# EAGLE schematic PCB Capacitor (EAGLE 9.6.2)
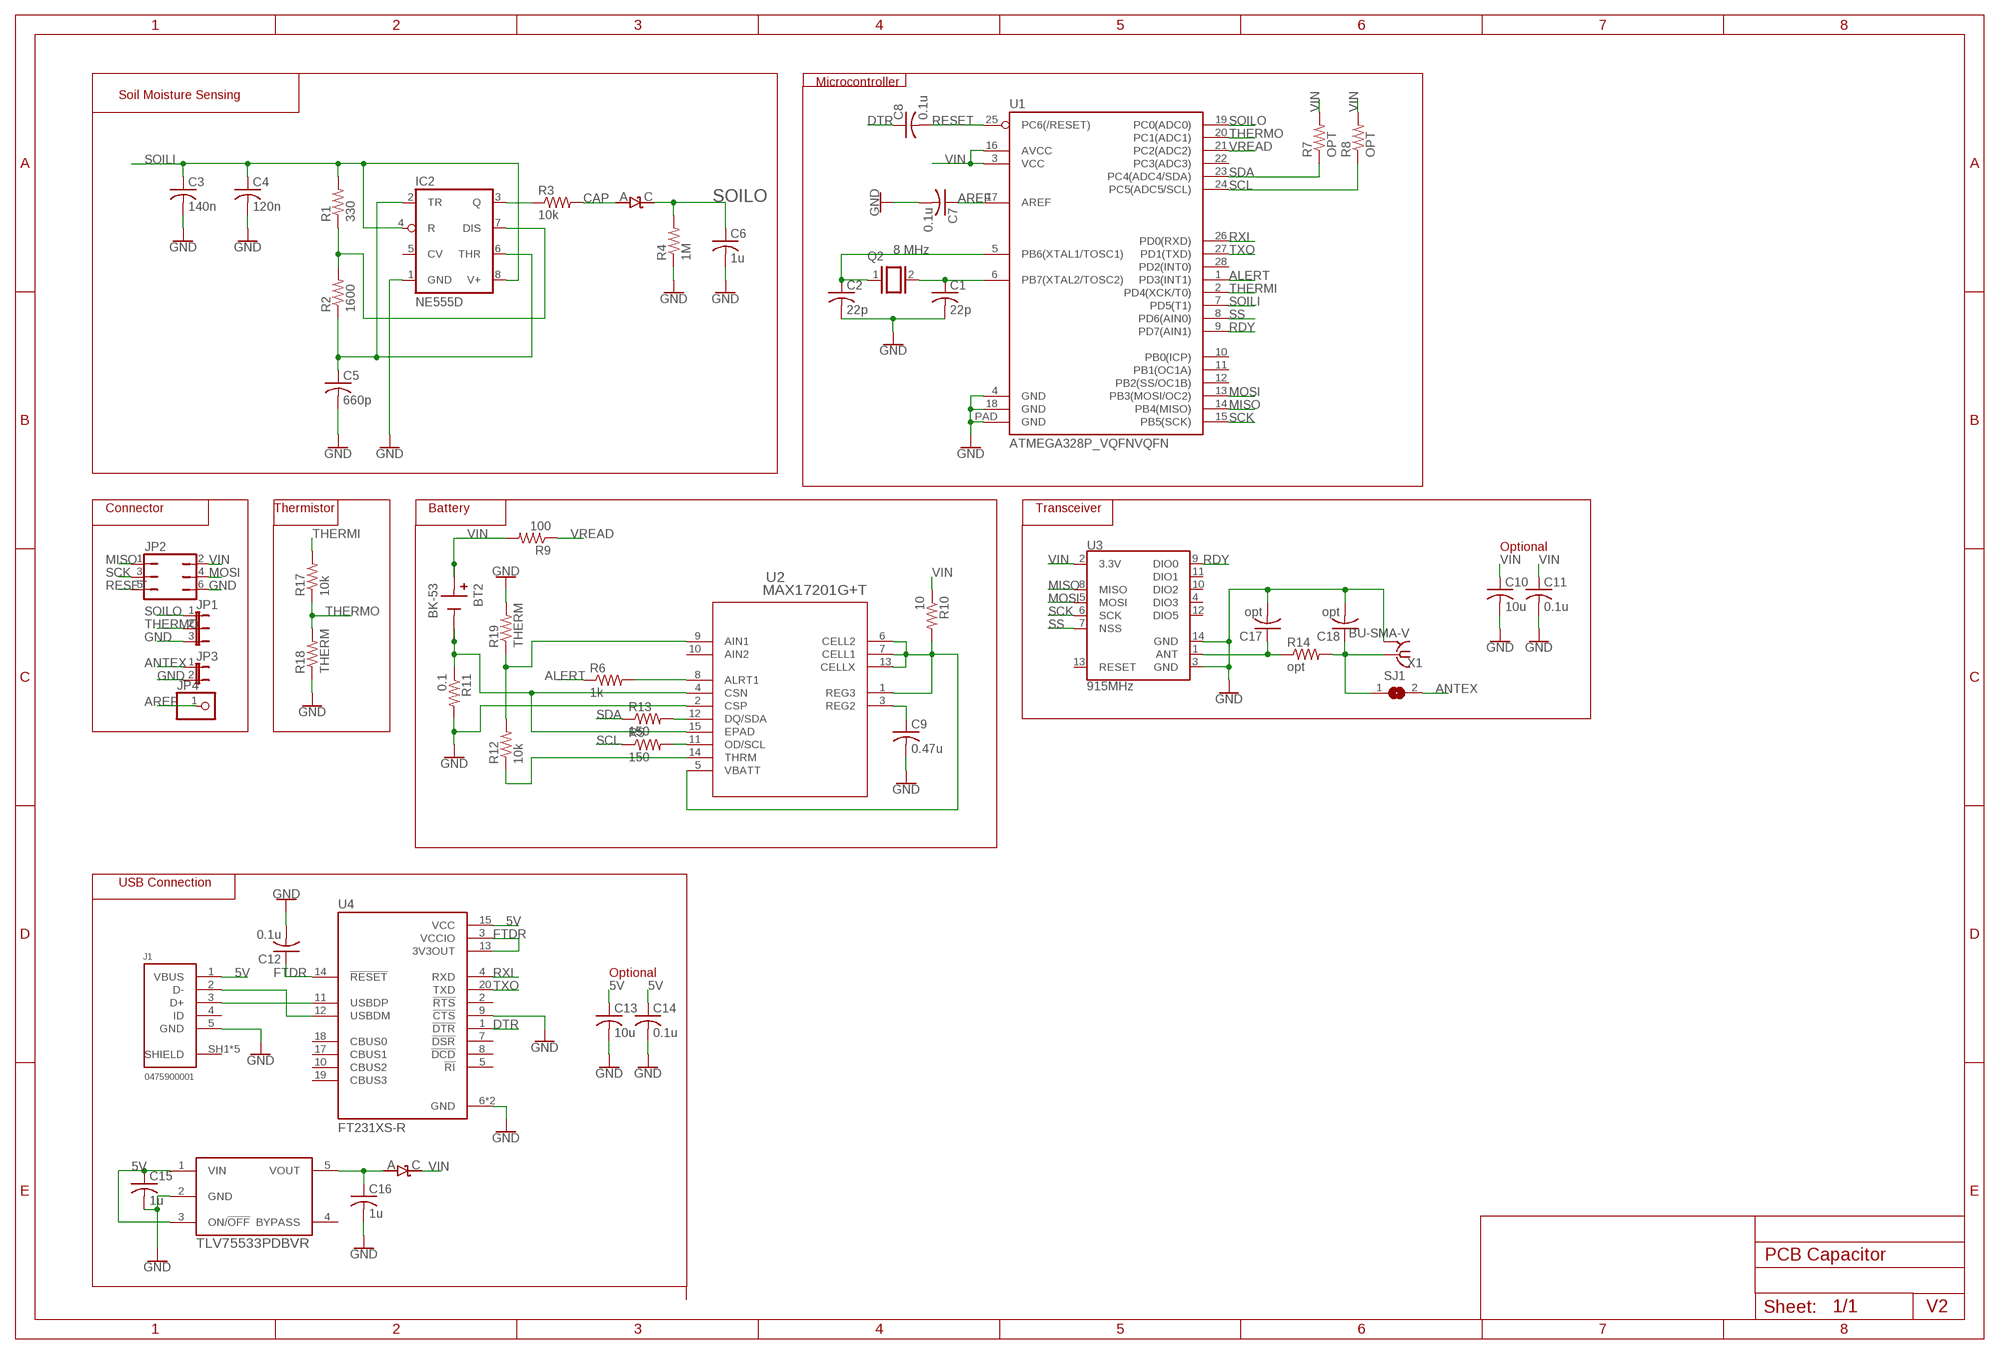
[diagram p0: schematic, sheet 1]

## Parts
BT2  BK-53  [BAT_BK-53]
C1  22p  C-USC0805  [C0805]
C2  22p  C-USC0805  [C0805]
C3  140n  C-USC0805  [C0805]
C4  120n  C-USC0805  [C0805]
C5  660p  C-USC0805  [C0805]
C6  1u  C-USC0805  [C0805]
C7  0.1u  C-USC0805  [C0805]
C8  0.1u  C-USC0805  [C0805]
C9  0.47u  C-USC0805  [C0805]
C10  10u  C-USC0805  [C0805]
C11  0.1u  C-USC0805  [C0805]
C12  0.1u  C-USC0805  [C0805]
C13  10u  C-USC0805  [C0805]
C14  0.1u  C-USC0805  [C0805]
C15  1u  C-USC0805  [C0805]
C16  1u  C-USC0805  [C0805]
C17  opt  C-USC0805  [C0805]
C18  opt  C-USC0805  [C0805]
D1  DIODE_SCHOTTKY_CMMSH2-40  [SOD-123]
D11  DIODE_SCHOTTKY_CMMSH2-40  [SOD-123]
IC2  NE555D  [SO08]
J1  0475900001  [0475900001]
JP1  JP2E  [JP2]
JP2  JP3Q  [JP3Q]
JP3  JP1E  [JP1]
JP4  PINHD-1X1  [1X01]
Q2  8 MHz  XTAL/S  [QS]
R1  330  R-US_R0603  [R0603]
R2  1600  R-US_R0603  [R0603]
R3  10k  R-US_R0603  [R0603]
R4  1M  R-US_R0603  [R0603]
R5  150  R-US_R0603  [R0603]
R6  1k  R-US_R0603  [R0603]
R7  OPT  R-US_R0603  [R0603]
R8  OPT  R-US_R0603  [R0603]
R9  100  R-US_R0603  [R0603]
R10  10  R-US_R0603  [R0603]
R11  0.1  R-US_R0603  [R0603]
R12  10k  R-US_R0603  [R0603]
R13  150  R-US_R0603  [R0603]
R14  opt  R-US_R0603  [R0603]
R17  10k  R-US_R0603  [R0603]
R18  THERM  R-US_R0603  [R0603]
R19  THERM  R-US_R0603  [R0603]
SJ1  SJ  [SJ]
TLV75533PDBVR  LP2985-33DBVR  [SOT-23-5]
U1  ATMEGA328P_VQFNVQFN  [VQFN-28]
U2  MAX17201G+T  [21-0137_T1433-2C_MXM]
U3  915MHz  RFM69CW-915MHZ  [RFM69CW-XXXS2]
U4  FT231XS-R  [SOP63P599X175-20N]
X1  BU-SMA-V  [BU-SMA-V]

## Nets
5V: C13.1 C14.1 C15.1 J1.1(VBUS) TLV75533PDBVR.1(VIN) TLV75533PDBVR.3(ON/!OFF!) U4.15(VCC)
ALERT: R6.1 U1.1(PD3(INT1))
ANTEX: JP3.1 SJ1.2
AREF: C7.1 JP4.1 U1.17(AREF)
CAP: D11.A R3.2
DTR: C8.1 U4.1(!DTR)
FTDR: C12.1 U4.3(VCCIO) U4.13(3V3OUT) U4.14(!RESET)
GND [Power]: C1.2 C2.2 C3.2 C4.2 C5.2 C6.2 C7.2 C9.2 C10.2 C11.2 C12.2 C13.2 C14.2 C15.2 C16.2 C17.2 C18.2 IC2.1(GND) J1.5(GND) JP1.3 JP2.6 JP3.2 R4.1 R11.2 R18.1 R19.2 TLV75533PDBVR.2(GND) U1.4(GND) U1.18(GND) U1.PAD(GND) U2.2(CSP) U3.3(GND) U3.14(GND) U4.6(GND) U4.9(!CTS) U4.16(GND) X1.2 X1.3 X1.4 X1.5
MISO: JP2.1 U1.14(PB4(MISO)) U3.8(MISO)
MOSI: JP2.4 U1.13(PB3(MOSI/OC2)) U3.5(MOSI)
N$1: R12.1 U2.14(THRM)
N$2: IC2.7(DIS) R1.1 R2.2
N$3: C5.1 IC2.2(TR) IC2.6(THR) R2.1
N$4: BT2.1-(-) BT2.2-(-) R11.1 U2.4(CSN) U2.15(EPAD)
N$5: C9.1 U2.3(REG2)
N$6: C1.1 Q2.2 U1.6(PB7(XTAL2/TOSC2))
N$7: C2.1 Q2.1 U1.5(PB6(XTAL1/TOSC1))
N$8: J1.2(D-) U4.12(USBDM)
N$9: IC2.3(Q) R3.1
N$10: J1.3(D+) U4.11(USBDP)
N$12: R10.2 U2.1(REG3) U2.5(VBATT) U2.6(CELL2) U2.7(CELL1) U2.13(CELLX)
N$13: R12.2 R19.1 U2.9(AIN1)
N$14: R6.2 U2.8(ALRT1)
N$15: R13.2 U2.12(DQ/SDA)
N$16: R5.2 U2.11(OD/SCL)
N$17: C16.1 D1.A TLV75533PDBVR.5(VOUT)
N$18: C17.1 R14.1 U3.1(ANT)
N$19: C18.1 R14.2 SJ1.1 X1.1
RDY: U1.9(PD7(AIN1)) U3.9(DIO0)
RESET: C8.2 JP2.5 U1.25(PC6(/RESET))
RXI: U1.26(PD0(RXD)) U4.4(RXD)
SCK: JP2.3 U1.15(PB5(SCK)) U3.6(SCK)
SCL: R5.1 R8.1 U1.24(PC5(ADC5/SCL))
SDA: R7.1 R13.1 U1.23(PC4(ADC4/SDA))
SOILI: C3.1 C4.1 IC2.4(R) IC2.8(V+) R1.2 U1.7(PD5(T1))
SOILO: C6.1 D11.C JP1.1 R4.2 U1.19(PC0(ADC0))
SS: U1.8(PD6(AIN0)) U3.7(NSS)
THERMI: R17.2 U1.2(PD4(XCK/T0))
THERMO: JP1.2 R17.1 R18.2 U1.20(PC1(ADC1))
TXO: U1.27(PD1(TXD)) U4.20(TXD)
VIN [Power]: BT2.1+(+) BT2.2+(+) C10.1 C11.1 D1.C JP2.2 R7.2 R8.2 R9.2 R10.1 U1.3(VCC) U1.16(AVCC) U3.2(3.3V)
VREAD: R9.1 U1.21(PC2(ADC2))
Unconnected: IC2.5(CV) J1.4(ID) TLV75533PDBVR.4(BYPASS) U1.10(PB0(ICP)) U1.11(PB1(OC1A)) U1.12(PB2(SS/OC1B)) U1.22(PC3(ADC3)) U1.28(PD2(INT0)) U2.10(AIN2) U3.4(DIO3) U3.10(DIO2) U3.11(DIO1) U3.12(DIO5) U3.13(RESET) U4.2(!RTS) U4.5(!RI) U4.7(!DSR) U4.8(!DCD) U4.10(CBUS2) U4.17(CBUS1) U4.18(CBUS0) U4.19(CBUS3)

## Notes on the sheet
- Microcontroller
- Soil Moisture Sensing
- Connector | Thermistor | Battery | Transceiver
- Optional
- USB Connection
- Optional
- V2

## Power pins joined to a net without a drawn wire
SHIELD: J1.SH1(SHIELD) J1.SH2(SHIELD) J1.SH3(SHIELD) J1.SH4(SHIELD) J1.SH5(SHIELD)

## Library data of the parts
BT2 = BK-53:BK-53: Battery Contact Clip AA 1 Cell SMD (SMT) Tab; DESCRIPTION: Battery Contact Clip AA 1 Cell SMD (SMT) Tab; DIGI-KEY_PART_NUMBER: BK-53-TR-ND; MF: MPD (Memory Protection Devices); MP: BK-53; PACKAGE: None; PURCHASE-URL: https://pricing.snapeda.com/search/part/BK-53/?ref=eda
C1-C18 = rcl:C-US: CAPACITOR, American symbol; SPICEPREFIX: C
D1 D11 = diode:DIODE_SCHOTTKY_CMMSH2-40
IC2 = linear:*555: TIMER
J1 = USB connector:0475900001: CONN RCPT MICRO USB AB 5P SMD RA Manufacturer's datasheet <https://www.molex.com/pdm_docs/sd/475900001_sd.pdf>; CREATED_BY: PCBLayout.com; DIGIKEY_PARTNO: WM17144TR-ND; MANUFACTURER: Molex; MPN: 0475900001
JP1 = jumper:JP2E: JUMPER
JP2 = jumper:JP3Q: JUMPER
JP3 = jumper:JP1E: JUMPER
JP4 = pinhead:PINHD-1X1: PIN HEADER
Q2 = special:XTAL/S: CRYSTAL
R1-R14 R17-R19 = rcl:R-US_: RESISTOR, American symbol; SPICEPREFIX: R
SJ1 = jumper:SJ: SMD solder JUMPER
TLV75533PDBVR = IC:LP2985-33DBVR: IC REG LINEAR 3.3V 150MA SOT23-5 Manufacturer's datasheet <http://www.ti.com/lit/ds/symlink/lp2985.pdf>; CREATED_BY: PCBLayout.com; DIGIKEY_PART_NUMBER: 296-18476-2-ND; MANUFACTURER: Texas Instruments; MPN: LP2985-33DBVR; PACKAGE: SOT-23-5
U1 = SparkFun-IC-Microcontroller:ATMEGA328P_VQFN: Atmel 328P QFN part not in catalog
U2 = MAX17201G+T:MAX17201G+T; BUILT_BY: UL_Team_Molly; COPYRIGHT: Copyright (C) 2018 Accelerated Designs. All rights reserved; MANUFACTURER_PART_NUMBER: MAX17201G+T; REVISION: 1; SOURCELIBRARY: Maxim_2018-10-24; VENDOR: Maxim Integrated Products
U3 = SparkFun-RF:RFM69: Hope RF RFM69CW ISM Transceiver Module The RFM69CW radio module by HopeRF is a compact, powerful radio transceiver module for swapping data packets in the 868 MHz ISM band, using standard and enhanced FSK modulation. The radio is great for sub-compact designs; just 4mm of mounted height from using an SMD precision crystal. Datasheet <http://www.hoperf.com/upload/rf/RFM69CW-V1.1.pdf>; PROD_ID: IC-11996
U4 = FT231XS-R:FT231XS-R: USB Full Speed to Full Handshake UART with USB Charger Detection; DESCRIPTION: USB Bridge, USB to UART USB 2.0 UART Interface 20-SSOP; DIGI-KEY_PART_NUMBER: 768-1129-1-ND; MF: FTDI,; MP: FT231XS-R; PACKAGE: SSOP-20 FTDI; PURCHASE-URL: https://pricing.snapeda.com/search/part/FT231XS-R/?ref=eda
X1 = con-coax:BU-SMA-V: FEMALE SMA CONNECTOR Radiall distributor RS 112-3794; OC_FARNELL: unknown; OC_NEWARK: unknown